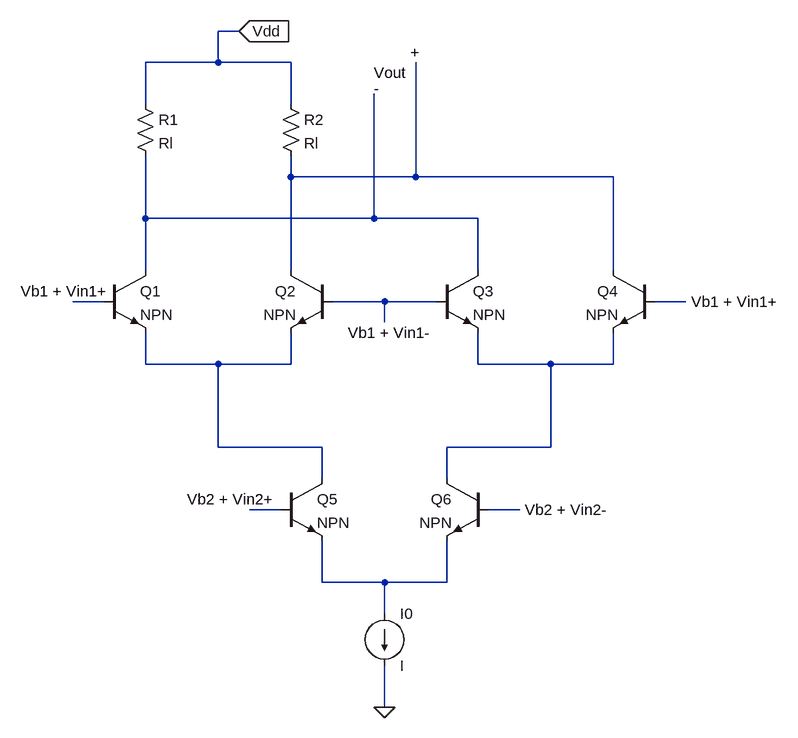
[diagram p0: schematic 1_Circuit.asc]
1_Circuit.asc, the LTspice schematic file:
Version 4
SHEET 1 1108 928
WIRE 272 -128 240 -128
WIRE 240 -80 240 -128
WIRE 240 -80 128 -80
WIRE 352 -80 240 -80
WIRE 128 -16 128 -80
WIRE 352 -16 352 -80
WIRE 352 96 352 64
WIRE 544 96 544 -80
WIRE 544 96 352 96
WIRE 848 96 544 96
WIRE 128 160 128 64
WIRE 480 160 480 -32
WIRE 480 160 128 160
WIRE 640 160 480 160
WIRE 128 240 128 160
WIRE 352 240 352 96
WIRE 640 240 640 160
WIRE 848 240 848 96
WIRE 64 288 16 288
WIRE 496 288 416 288
WIRE 576 288 496 288
WIRE 960 288 912 288
WIRE 496 320 496 288
WIRE 128 384 128 336
WIRE 240 384 128 384
WIRE 352 384 352 336
WIRE 352 384 240 384
WIRE 640 384 640 336
WIRE 752 384 640 384
WIRE 848 384 848 336
WIRE 848 384 752 384
WIRE 240 512 240 384
WIRE 400 512 240 512
WIRE 752 512 752 384
WIRE 752 512 592 512
WIRE 400 560 400 512
WIRE 592 560 592 512
WIRE 336 608 288 608
WIRE 704 608 656 608
WIRE 400 720 400 656
WIRE 496 720 400 720
WIRE 592 720 592 656
WIRE 592 720 496 720
WIRE 496 768 496 720
WIRE 496 912 496 848
FLAG 272 -128 Vdd
IOPIN 272 -128 In
FLAG 496 912 0
SYMBOL npn 64 240 R0
SYMATTR InstName Q1
SYMBOL npn 416 240 M0
SYMATTR InstName Q2
SYMBOL npn 576 240 R0
SYMATTR InstName Q3
SYMBOL npn 912 240 M0
SYMATTR InstName Q4
SYMBOL res 112 -32 R0
SYMATTR InstName R1
SYMATTR Value Rl
SYMBOL res 336 -32 R0
SYMATTR InstName R2
SYMATTR Value Rl
SYMBOL npn 336 560 R0
SYMATTR InstName Q5
SYMBOL npn 656 560 M0
SYMATTR InstName Q6
SYMBOL current 496 768 R0
SYMATTR InstName I0
TEXT 440 336 Left 2 !Vb1 + Vin1-
TEXT 968 288 Left 2 !Vb1 + Vin1+
TEXT -64 272 Left 2 !Vb1 + Vin1+
TEXT 536 -96 Left 2 !+
TEXT 480 -40 Left 2 !-
TEXT 480 -64 Left 2 !Vout
TEXT 192 592 Left 2 !Vb2 + Vin2+
TEXT 712 608 Left 2 !Vb2 + Vin2-

The netlist it stands for:
* 1_Circuit.asc
Q1 N002 N003 N006 0 NPN
Q2 N001 N004 N006 0 NPN
Q3 N002 N004 N007 0 NPN
Q4 N001 N005 N007 0 NPN
R1 Vdd N002 Rl
R2 Vdd N001 Rl
Q5 N006 N008 N010 0 NPN
Q6 N007 N009 N010 0 NPN
I0 N010 0 I
.model NPN NPN
.model PNP PNP
.lib standard.bjt
Vb1 + Vin1-
Vb1 + Vin1+
Vb1 + Vin1+
+
-
Vout
Vb2 + Vin2+
Vb2 + Vin2-
.backanno
.end